# Altium project BOLLBOT.PrjPCB
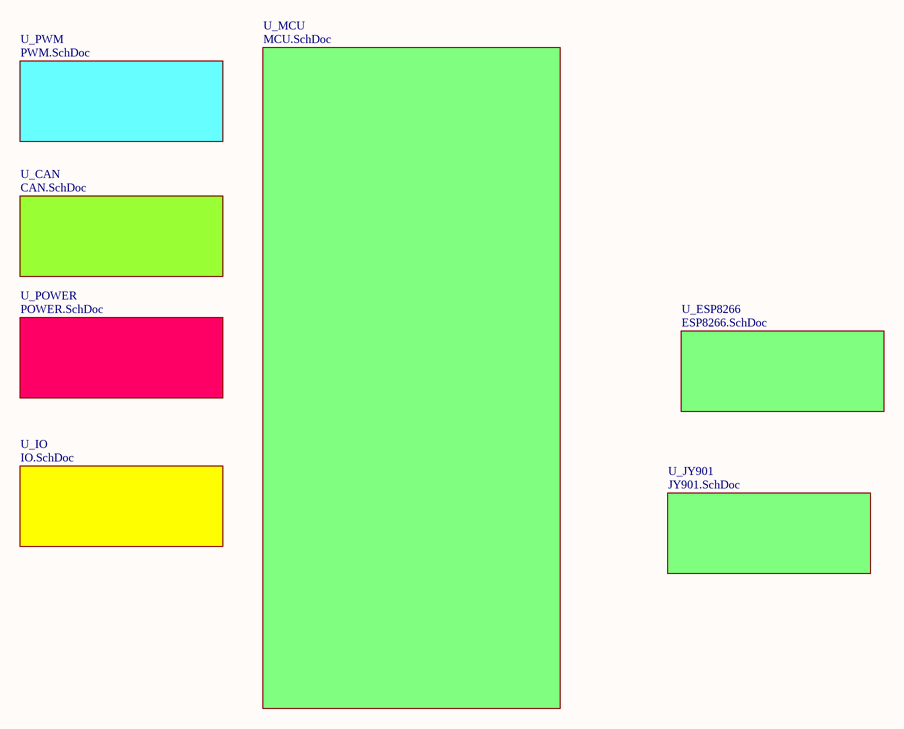
[diagram p0: Bollbot_V100.SchDoc]
8 sheets, 132 parts. Net scope: flat (ports and power ports of the same name join across sheets).
Board file: Bollbot_V100.PcbDoc
Sheets:
  Bollbot_V100.SchDoc
    U_MCU = MCU.SchDoc
    U_IO = IO.SchDoc
    U_CAN = CAN.SchDoc
    U_PWM = PWM.SchDoc
    U_POWER = Power.SchDoc
    U_ESP8266 = ESP8266.SchDoc
    U_JY901 = JY901.SchDoc

## Sheet Bollbot_V100.SchDoc
size A4

### Sub-sheets
U_CAN = CAN.SchDoc: no entries
U_ESP8266 = ESP8266.SchDoc: no entries
U_IO = IO.SchDoc: no entries
U_JY901 = JY901.SchDoc: no entries
U_MCU = MCU.SchDoc: no entries
U_POWER = POWER.SchDoc: no entries
U_PWM = PWM.SchDoc: no entries

## Sheet MCU.SchDoc
size A3
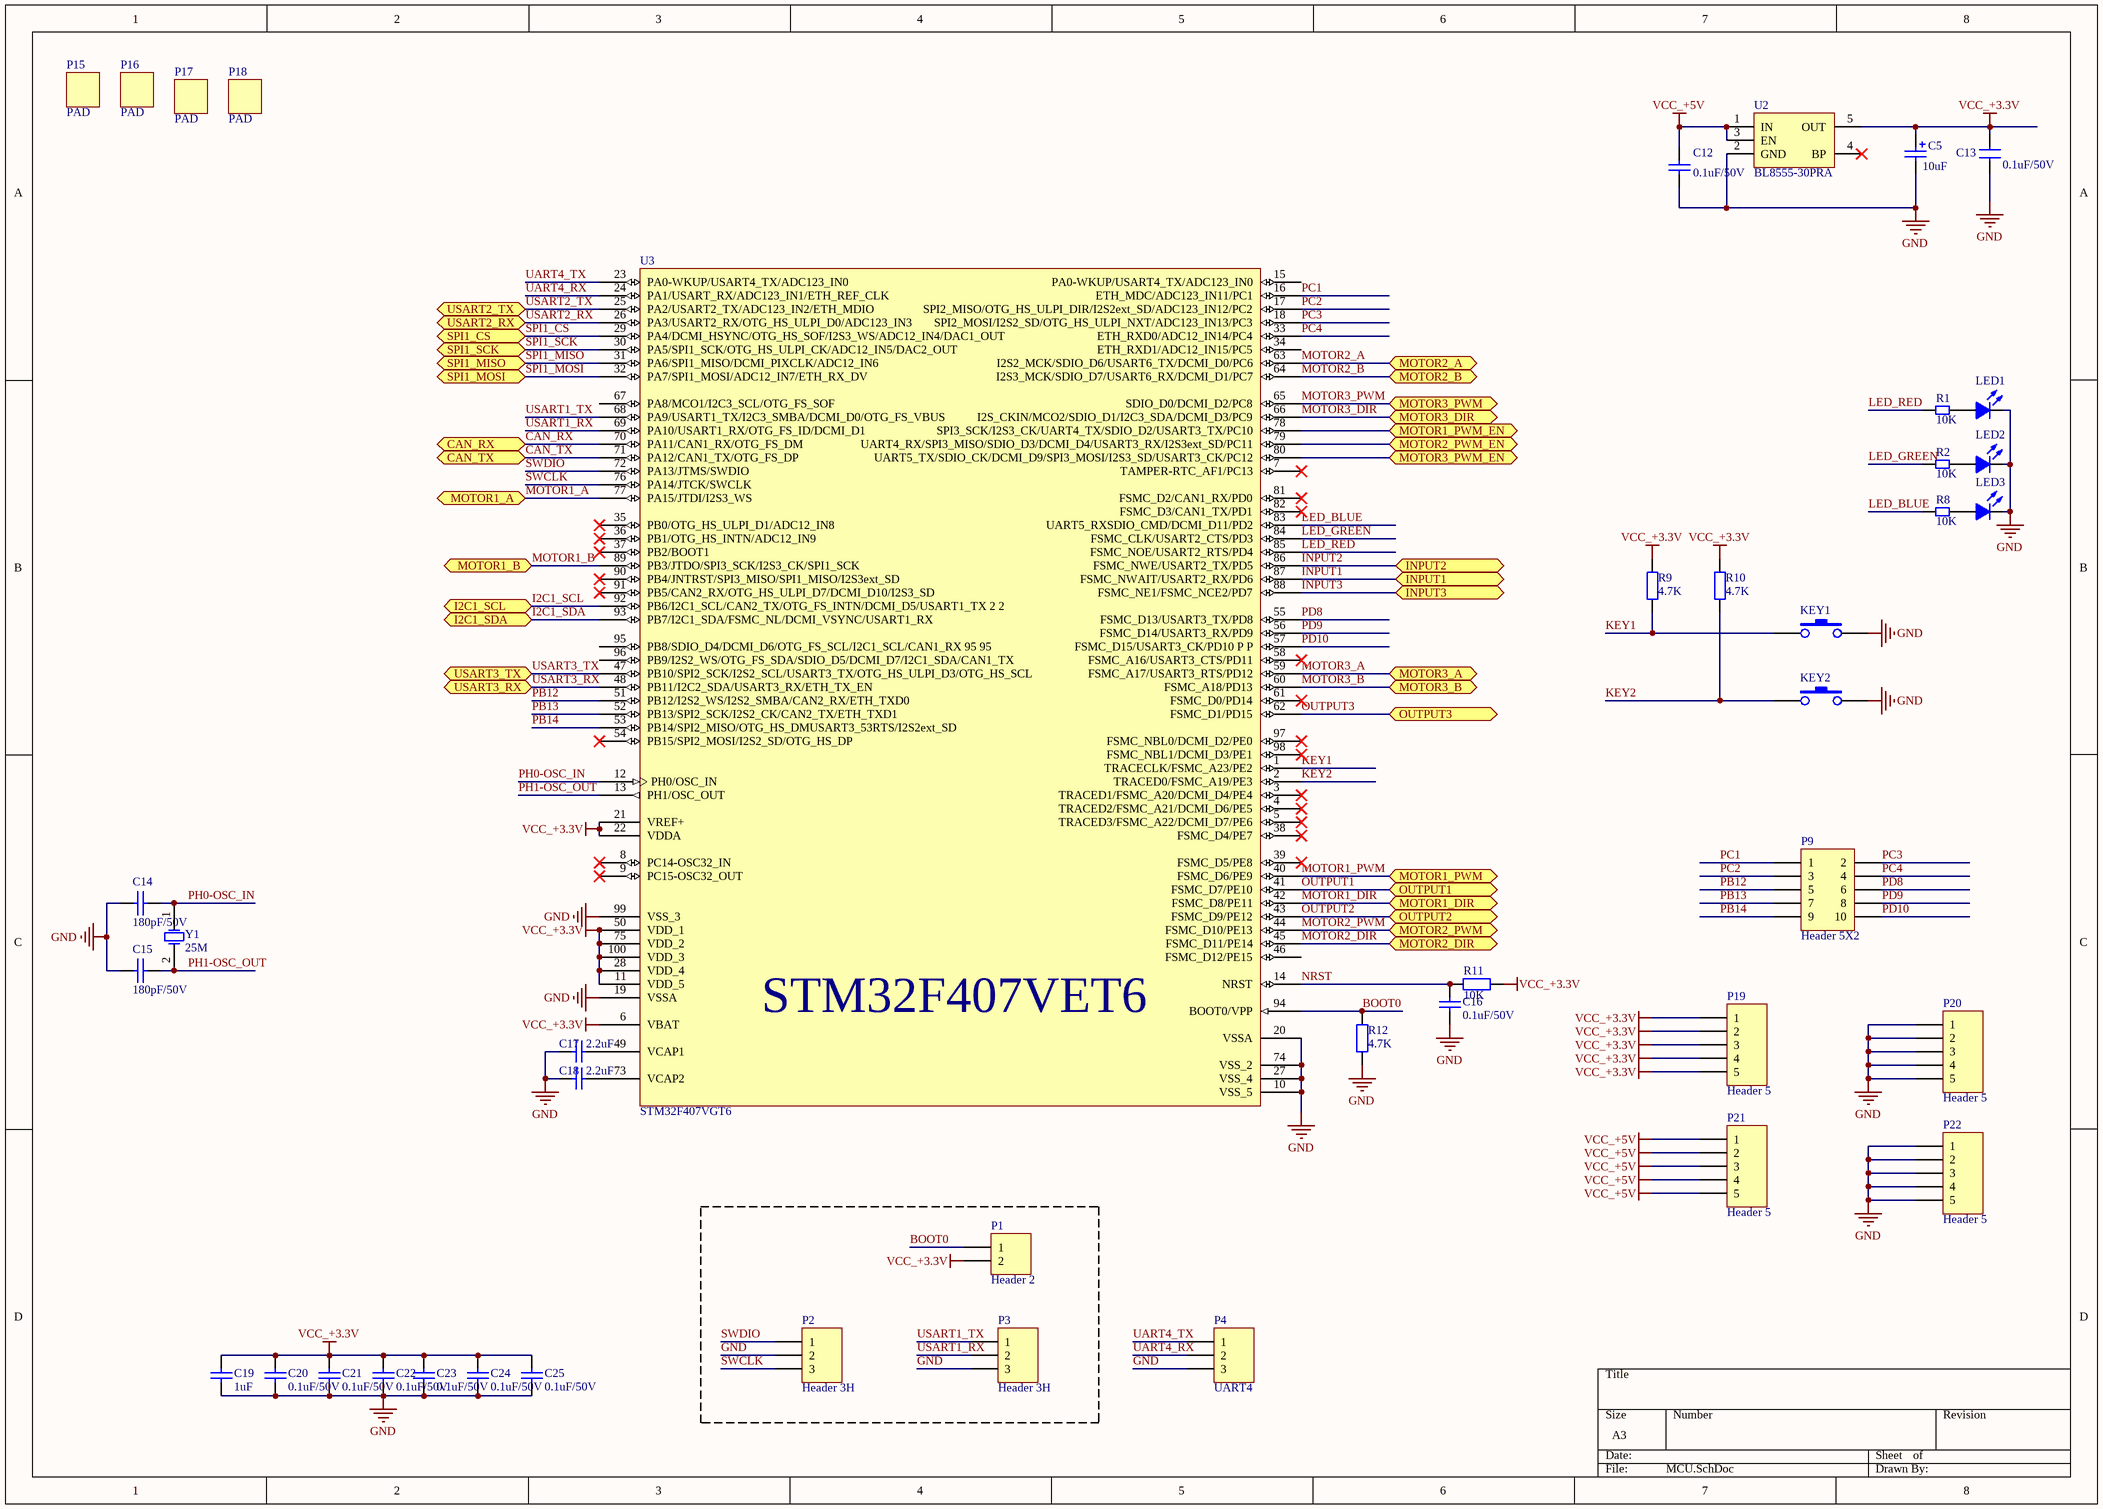
[diagram p1: MCU.SchDoc]

### Parts
C5  10uF  [CAPTANC]
C12  0.1uF/50V  [0603C]
C13  0.1uF/50V  [0603C]
C14  180pF/50V  [0603C]
C15  180pF/50V  [0603C]
C16  0.1uF/50V  [0603C]
C17  2.2uF  [0603C]
C18  2.2uF  [0603C]
C19  1uF  [0603C]
C20  0.1uF/50V  [0603C]
C21  0.1uF/50V  [0603C]
C22  0.1uF/50V  [0603C]
C23  0.1uF/50V  [0603C]
C24  0.1uF/50V  [0603C]
C25  0.1uF/50V  [0603C]
KEY1  (no value)  [KEY_SMT]
KEY2  (no value)  [KEY_SMT]
LED1  LED  [LED-0603]  (value not drawn)
LED2  LED  [LED-0603]  (value not drawn)
LED3  LED  [LED-0603]  (value not drawn)
P1  Header 2  [HDR1*2]
P2  Header 3H  [XH254-3P]
P3  Header 3H  [XH254-3P]
P4  UART4  [XH254-3P]
P9  Header 5X2  [HDR2X5]
P15  PAD  [PAD 3mm]
P16  PAD  [PAD 3mm]
P17  PAD  [PAD 3mm]
P18  PAD  [PAD 3mm]
P19  Header 5  [HDR1X5]
P20  Header 5  [HDR1X5]
P21  Header 5  [HDR1X5]
P22  Header 5  [HDR1X5]
R1  10K  [0603R]
R2  10K  [0603R]
R8  10K  [0603R]
R9  4.7K  [0603R]
R10  4.7K  [0603R]
R11  10K  [0603R]
R12  4.7K  [0603R]
U2  BL8555-30PRA  [SOT23-5]
U3  STM32F407VGT6  [LQFP-100_14x14x05P]
Y1  25M  [XTAL]

### Ports
CAN_RX (bidir), CAN_TX (bidir), I2C1_SCL, I2C1_SDA, INPUT1, INPUT2, INPUT3, MOTOR1_A, MOTOR1_B, MOTOR1_DIR, MOTOR1_PWM, MOTOR1_PWM_EN, MOTOR2_A, MOTOR2_B, MOTOR2_DIR, MOTOR2_PWM, MOTOR2_PWM_EN, MOTOR3_A, MOTOR3_B, MOTOR3_DIR, MOTOR3_PWM, MOTOR3_PWM_EN, OUTPUT1, OUTPUT2, OUTPUT3, SPI1_CS, SPI1_MISO, SPI1_MOSI, SPI1_SCK, USART2_RX (bidir), USART2_TX (bidir), USART3_RX (bidir), USART3_TX (bidir)

### Nets
GND: C5.2 C12.1 C13.2 C14.1 C15.1 C16.1 C17.2 C18.2 C19.1 C20.1 C21.1 C22.1 C23.1 C24.1 C25.1 KEY1.2 KEY2.2 LED1.2(K) LED2.2(K) LED3.2(K) P2.2 P3.3 P4.3 P20.1 P20.2 P20.3 P20.4 P20.5 P22.1 P22.2 P22.3 P22.4 P22.5 R12.1 U2.2(GND) U3.10(VSS_5) U3.19(VSSA) U3.20(VSSA) U3.27(VSS_4) U3.74(VSS_2) U3.99(VSS_3)
VCC_+3.3V: C5.1 C13.1 C19.2 C20.2 C21.2 C22.2 C23.2 C24.2 C25.2 P1.2 P19.1 P19.2 P19.3 P19.4 P19.5 R9.1 R10.1 R11.1 U2.5(OUT) U3.6(VBAT) U3.11(VDD_5) U3.21(VREF+) U3.22(VDDA) U3.28(VDD_4) U3.50(VDD_1) U3.75(VDD_2) U3.100(VDD_3)
VCC_+5V: C12.2 P21.1 P21.2 P21.3 P21.4 P21.5 U2.1(IN) U2.3(EN)
BOOT0: P1.1 R12.2 U3.94(BOOT0/VPP)
CAN_RX: U3.70(PA11/CAN1_RX/OTG_FS_DM) ; port CAN_RX
CAN_TX: U3.71(PA12/CAN1_TX/OTG_FS_DP) ; port CAN_TX
I2C1_SCL: U3.92(PB6/I2C1_SCL/CAN2_TX/OTG_FS_INTN/DCMI_D5/USART1_TX_2_2) ; port I2C1_SCL
I2C1_SDA: U3.93(PB7/I2C1_SDA/FSMC_NL/DCMI_VSYNC/USART1_RX) ; port I2C1_SDA
INPUT1: U3.87(FSMC_NWAIT/USART2_RX/PD6) ; port INPUT1
INPUT2: U3.86(FSMC_NWE/USART2_TX/PD5) ; port INPUT2
INPUT3: U3.88(FSMC_NE1/FSMC_NCE2/PD7) ; port INPUT3
KEY1: KEY1.1 R9.2 U3.1(TRACECLK/FSMC_A23/PE2)
KEY2: KEY2.1 R10.2 U3.2(TRACED0/FSMC_A19/PE3)
LED_BLUE: R8.1 U3.83(UART5_RXSDIO_CMD/DCMI_D11/PD2)
LED_GREEN: R2.1 U3.84(FSMC_CLK/USART2_CTS/PD3)
LED_RED: R1.1 U3.85(FSMC_NOE/USART2_RTS/PD4)
MOTOR1_A: U3.77(PA15/JTDI/I2S3_WS) ; port MOTOR1_A
MOTOR1_B: U3.89(PB3/JTDO/SPI3_SCK/I2S3_CK/SPI1_SCK) ; port MOTOR1_B
MOTOR1_DIR: U3.42(FSMC_D8/PE11) ; port MOTOR1_DIR
MOTOR1_PWM: U3.40(FSMC_D6/PE9) ; port MOTOR1_PWM
MOTOR2_A: U3.63(I2S2_MCK/SDIO_D6/USART6_TX/DCMI_D0/PC6) ; port MOTOR2_A
MOTOR2_B: U3.64(I2S3_MCK/SDIO_D7/USART6_RX/DCMI_D1/PC7) ; port MOTOR2_B
MOTOR2_DIR: U3.45(FSMC_D11/PE14) ; port MOTOR2_DIR
MOTOR2_PWM: U3.44(FSMC_D10/PE13) ; port MOTOR2_PWM
MOTOR3_A: U3.59(FSMC_A17/USART3_RTS/PD12) ; port MOTOR3_A
MOTOR3_B: U3.60(FSMC_A18/PD13) ; port MOTOR3_B
MOTOR3_DIR: U3.66(I2S_CKIN/MCO2/SDIO_D1/I2C3_SDA/DCMI_D3/PC9) ; port MOTOR3_DIR
MOTOR3_PWM: U3.65(SDIO_D0/DCMI_D2/PC8) ; port MOTOR3_PWM
NRST: C16.2 R11.2 U3.14(NRST)
OUTPUT1: U3.41(FSMC_D7/PE10) ; port OUTPUT1
OUTPUT2: U3.43(FSMC_D9/PE12) ; port OUTPUT2
OUTPUT3: U3.62(FSMC_D1/PD15) ; port OUTPUT3
PB12: P9.5 U3.51(PB12/I2S2_WS/I2S2_SMBA/CAN2_RX/ETH_TXD0)
PB13: P9.7 U3.52(PB13/SPI2_SCK/I2S2_CK/CAN2_TX/ETH_TXD1)
PB14: P9.9 U3.53(PB14/SPI2_MISO/OTG_HS_DMUSART3_53RTS/I2S2ext_SD)
PC1: P9.1 U3.16(ETH_MDC/ADC123_IN11/PC1)
PC2: P9.3 U3.17(SPI2_MISO/OTG_HS_ULPI_DIR/I2S2ext_SD/ADC123_IN12/PC2)
PC3: P9.2 U3.18(SPI2_MOSI/I2S2_SD/OTG_HS_ULPI_NXT/ADC123_IN13/PC3)
PC4: P9.4 U3.33(ETH_RXD0/ADC12_IN14/PC4)
PD8: P9.6 U3.55(FSMC_D13/USART3_TX/PD8)
PD9: P9.8 U3.56(FSMC_D14/USART3_RX/PD9)
PD10: P9.10 U3.57(FSMC_D15/USART3_CK/PD10_P_P)
PH0-OSC_IN: C14.2 U3.12(PH0/OSC_IN) Y1.1(OSC1)
PH1-OSC_OUT: C15.2 U3.13(PH1/OSC_OUT) Y1.2(OSC2)
SPI1_CS: U3.29(PA4/DCMI_HSYNC/OTG_HS_SOF/I2S3_WS/ADC12_IN4/DAC1_OUT) ; port SPI1_CS
SPI1_MISO: U3.31(PA6/SPI1_MISO/DCMI_PIXCLK/ADC12_IN6) ; port SPI1_MISO
SPI1_MOSI: U3.32(PA7/SPI1_MOSI/ADC12_IN7/ETH_RX_DV) ; port SPI1_MOSI
SPI1_SCK: U3.30(PA5/SPI1_SCK/OTG_HS_ULPI_CK/ADC12_IN5/DAC2_OUT) ; port SPI1_SCK
SWCLK: P2.3 U3.76(PA14/JTCK/SWCLK)
SWDIO: P2.1 U3.72(PA13/JTMS/SWDIO)
UART4_RX: P4.2 U3.24(PA1/USART_RX/ADC123_IN1/ETH_REF_CLK)
UART4_TX: P4.1 U3.23(PA0-WKUP/USART4_TX/ADC123_IN0)
USART1_RX: P3.2 U3.69(PA10/USART1_RX/OTG_FS_ID/DCMI_D1)
USART1_TX: P3.1 U3.68(PA9/USART1_TX/I2C3_SMBA/DCMI_D0/OTG_FS_VBUS)
USART2_RX: U3.26(PA3/USART2_RX/OTG_HS_ULPI_D0/ADC123_IN3) ; port USART2_RX
USART2_TX: U3.25(PA2/USART2_TX/ADC123_IN2/ETH_MDIO) ; port USART2_TX
USART3_RX: U3.48(PB11/I2C2_SDA/USART3_RX/ETH_TX_EN) ; port USART3_RX
USART3_TX: U3.47(PB10/SPI2_SCK/I2S2_SCL/USART3_TX/OTG_HS_ULPI_D3/OTG_HS_SCL) ; port USART3_TX
NetC17_1: C17.1 U3.49(VCAP1)
NetC18_1: C18.1 U3.73(VCAP2)
NetLED1_1: LED1.1(A) R1.2
NetLED2_1: LED2.1(A) R2.2
NetLED3_1: LED3.1(A) R8.2
NetU3_78: U3.78(SPI3_SCK/I2S3_CK/UART4_TX/SDIO_D2/USART3_TX/PC10) ; port MOTOR1_PWM_EN
NetU3_79: U3.79(UART4_RX/SPI3_MISO/SDIO_D3/DCMI_D4/USART3_RX/I2S3ext_SD/PC11) ; port MOTOR2_PWM_EN
NetU3_80: U3.80(UART5_TX/SDIO_CK/DCMI_D9/SPI3_MOSI/I2S3_SD/USART3_CK/PC12) ; port MOTOR3_PWM_EN

Not connected (* = marked no-connect by the designer): U2 4(BP)*; U3 3(TRACED1/FSMC_A20/DCMI_D4/PE4)* 4(TRACED2/FSMC_A21/DCMI_D6/PE5)* 5(TRACED3/FSMC_A22/DCMI_D7/PE6)* 7(TAMPER-RTC_AF1/PC13)* 8(PC14-OSC32_IN)* 9(PC15-OSC32_OUT)* 15(PA0-WKUP/USART4_TX/ADC123_IN0) 34(ETH_RXD1/ADC12_IN15/PC5) 35(PB0/OTG_HS_ULPI_D1/ADC12_IN8)* 36(PB1/OTG_HS_INTN/ADC12_IN9)* 37(PB2/BOOT1)* 38(FSMC_D4/PE7)* 39(FSMC_D5/PE8)* 46(FSMC_D12/PE15) 54(PB15/SPI2_MOSI/I2S2_SD/OTG_HS_DP)* 58(FSMC_A16/USART3_CTS/PD11)* 61(FSMC_D0/PD14)* 67(PA8/MCO1/I2C3_SCL/OTG_FS_SOF) 81(FSMC_D2/CAN1_RX/PD0)* 82(FSMC_D3/CAN1_TX/PD1)* 90(PB4/JNTRST/SPI3_MISO/SPI1_MISO/I2S3ext_SD)* 91(PB5/CAN2_RX/OTG_HS_ULPI_D7/DCMI_D10/I2S3_SD)* 95(PB8/SDIO_D4/DCMI_D6/OTG_FS_SCL/I2C1_SCL/CAN1_RX_95_95) 96(PB9/I2S2_WS/OTG_FS_SDA/SDIO_D5/DCMI_D7/I2C1_SDA/CAN1_TX) 97(FSMC_NBL0/DCMI_D2/PE0)* 98(FSMC_NBL1/DCMI_D3/PE1)*

### Notes on the sheet
- (in symbol STM32F407VGT6) STM32F407VET6

### Library data of the parts
C5 = Cap Pol: Polarized Capacitor (Radial); Published: 8-Jun-2000; LatestRevisionDate: 17-Jul-2002; LatestRevisionNote: Re-released for DXP Platform.; Publisher: Altium Limited; Value: 10uF
C12 C16-C25 = Cap: Capacitor; Value: 104; Published: 8-Jun-2000; LatestRevisionDate: 17-Jul-2002; LatestRevisionNote: Re-released for DXP Platform.; Publisher: Altium Limited
C13 = CAP
C14 C15 = 0603C
KEY1 KEY2 = SW-PB
LED1-LED3 = LED: Typical INFRARED GaAs LED; Published: 8-Jun-2000; LatestRevisionDate: 17-Jul-2002; LatestRevisionNote: Re-released for DXP Platform.; Publisher: Altium Limited
P1 = Header 2: Header, 2-Pin; LatestRevisionDate: 17-Jul-2002; LatestRevisionNote: Re-released for DXP Platform.; Publisher: Altium Limited
P2-P4 = Header 3H: Header, 3-Pin, Right Angle; LatestRevisionDate: 17-Jul-2002; LatestRevisionNote: Re-released for DXP Platform.; Publisher: Altium Limited
P9 = Header 5X2: Header, 5-Pin, Dual row; LatestRevisionDate: 17-Jul-2002; LatestRevisionNote: Re-released for DXP Platform.; Publisher: Altium Limited
P19-P22 = Header 5: Header, 5-Pin; LatestRevisionDate: 17-Jul-2002; LatestRevisionNote: Re-released for DXP Platform.; Publisher: Altium Limited
R1 R2 R8 = Res2: Resistor; Value: 1K; Published: 8-Jun-2000; LatestRevisionDate: 17-Jul-2002; LatestRevisionNote: Re-released for DXP Platform.; Publisher: Altium Limited
R9-R12 = 0603R
U2 = SGM2019
Y1 = XTAL: Crystal Oscillator; Published: 8-Jun-2000; LatestRevisionDate: 17-Jul-2002; LatestRevisionNote: Re-released for DXP Platform.; PackageReference: R38; Publisher: Altium Limited

## Sheet IO.SchDoc
size A4
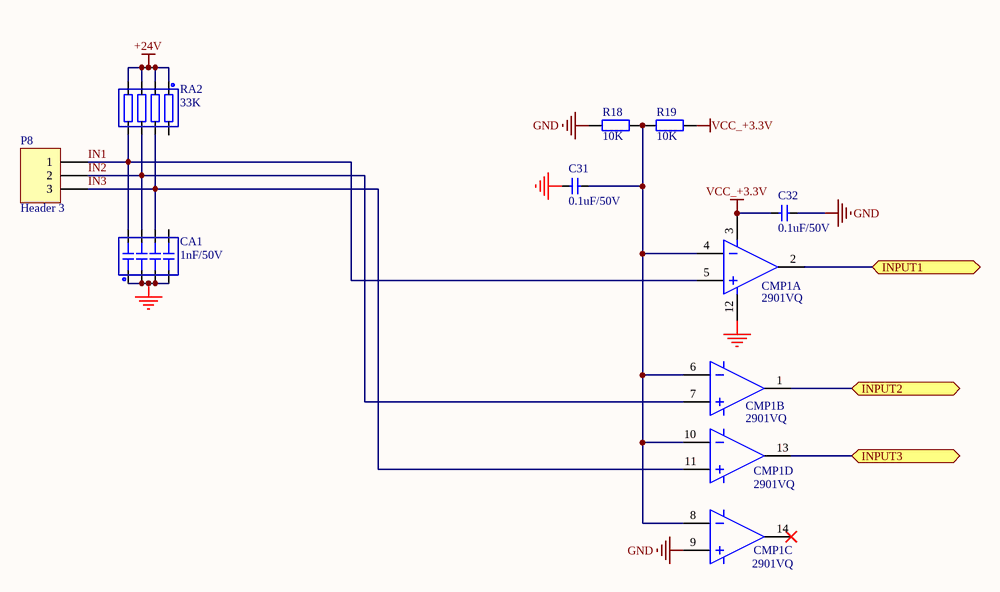
[diagram p2: IO.SchDoc]

### Parts
C31  0.1uF/50V  [0603c]
C32  0.1uF/50V  [0603C]
CA1  1nF/50V  [RES_PACK_SMD_E]
CMP1  2901VQ  [TSSOP14]  (parts A,B,C,D of 4)
P8  Header 3  [HT396  3P]
R18  10K  [0603R]
R19  10K  [0603R]
RA2  33K  [RES_PACK_SMD_E]

### Ports
INPUT1, INPUT2, INPUT3

### Nets
+24V: RA2.1 RA2.2 RA2.3 RA2.4
GND: C31.2 C32.2 CA1.1 CA1.2 CA1.3 CA1.4 CMP1.9 CMP1.12 R18.1
VCC_+3.3V: C32.1 CMP1.3 R19.2
IN1: CA1.8 CMP1.5 P8.1 RA2.5
IN2: CA1.7 CMP1.7 P8.2 RA2.6
IN3: CA1.6 CMP1.11 P8.3 RA2.7
INPUT1: CMP1.2 ; port INPUT1
INPUT2: CMP1.1 ; port INPUT2
INPUT3: CMP1.13 ; port INPUT3
NetC31_1: C31.1 CMP1.4 CMP1.6 CMP1.8 CMP1.10 R18.2 R19.1

Not connected (* = marked no-connect by the designer): CA1 5; CMP1 14*; RA2 8

### Library data of the parts
C31 C32 = CAP
CA1 = CAP_PACK4
CMP1 = LM339
P8 = Header 3: Header, 3-Pin; LatestRevisionDate: 17-Jul-2002; LatestRevisionNote: Re-released for DXP Platform.; Publisher: Altium Limited
R18 R19 = 0603R
RA2 = RESPACK4

## Sheet CAN.SchDoc
size A4
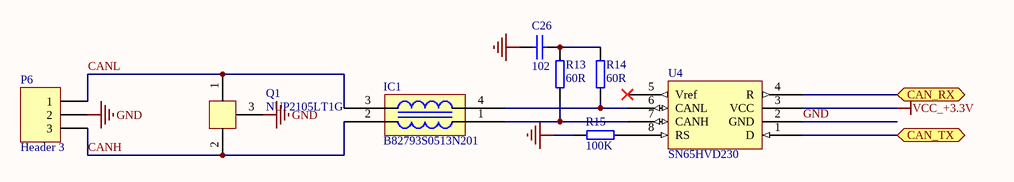
[diagram p3: CAN.SchDoc]

### Parts
C26  102  [0603C]
IC1  B82793S0513N201  [EPCOS_Chokes]
P6  Header 3  [XH254-3P]
Q1  NUP2105LT1G  [SOT23]
R13  60R  [0603R]
R14  60R  [0603R]
R15  100K  [0603R]
U4  SN65HVD230  [SOP8]

### Ports
CAN_RX (bidir), CAN_TX (bidir)

### Nets
GND: C26.1 P6.2 Q1.3 R15.2 U4.2(GND)
VCC_+3.3V: U4.3(VCC)
CAN_RX: U4.4(R) ; port CAN_RX
CAN_TX: U4.1(D) ; port CAN_TX
CANH: IC1.2 P6.3 Q1.2
CANL: IC1.3 P6.1 Q1.1
NetC26_2: C26.2 R13.2 R14.2
NetIC1_1: IC1.1 R13.1 U4.7(CANH)
NetIC1_4: IC1.4 R14.1 U4.6(CANL)
NetR15_1: R15.1 U4.8(RS)

Not connected (* = marked no-connect by the designer): U4 5(Vref)*

### Library data of the parts
C26 = CAP: Capacitor
IC1 = EPCOS Chokes: Common-mode chokes, ring core
P6 = Header 3: Header, 3-Pin; LatestRevisionDate: 17-Jul-2002; LatestRevisionNote: Re-released for DXP Platform.; Publisher: Altium Limited
Q1 = SOT23
R13-R15 = RES2A
U4 = SN65HVD230D

## Sheet PWM.SchDoc
size A4
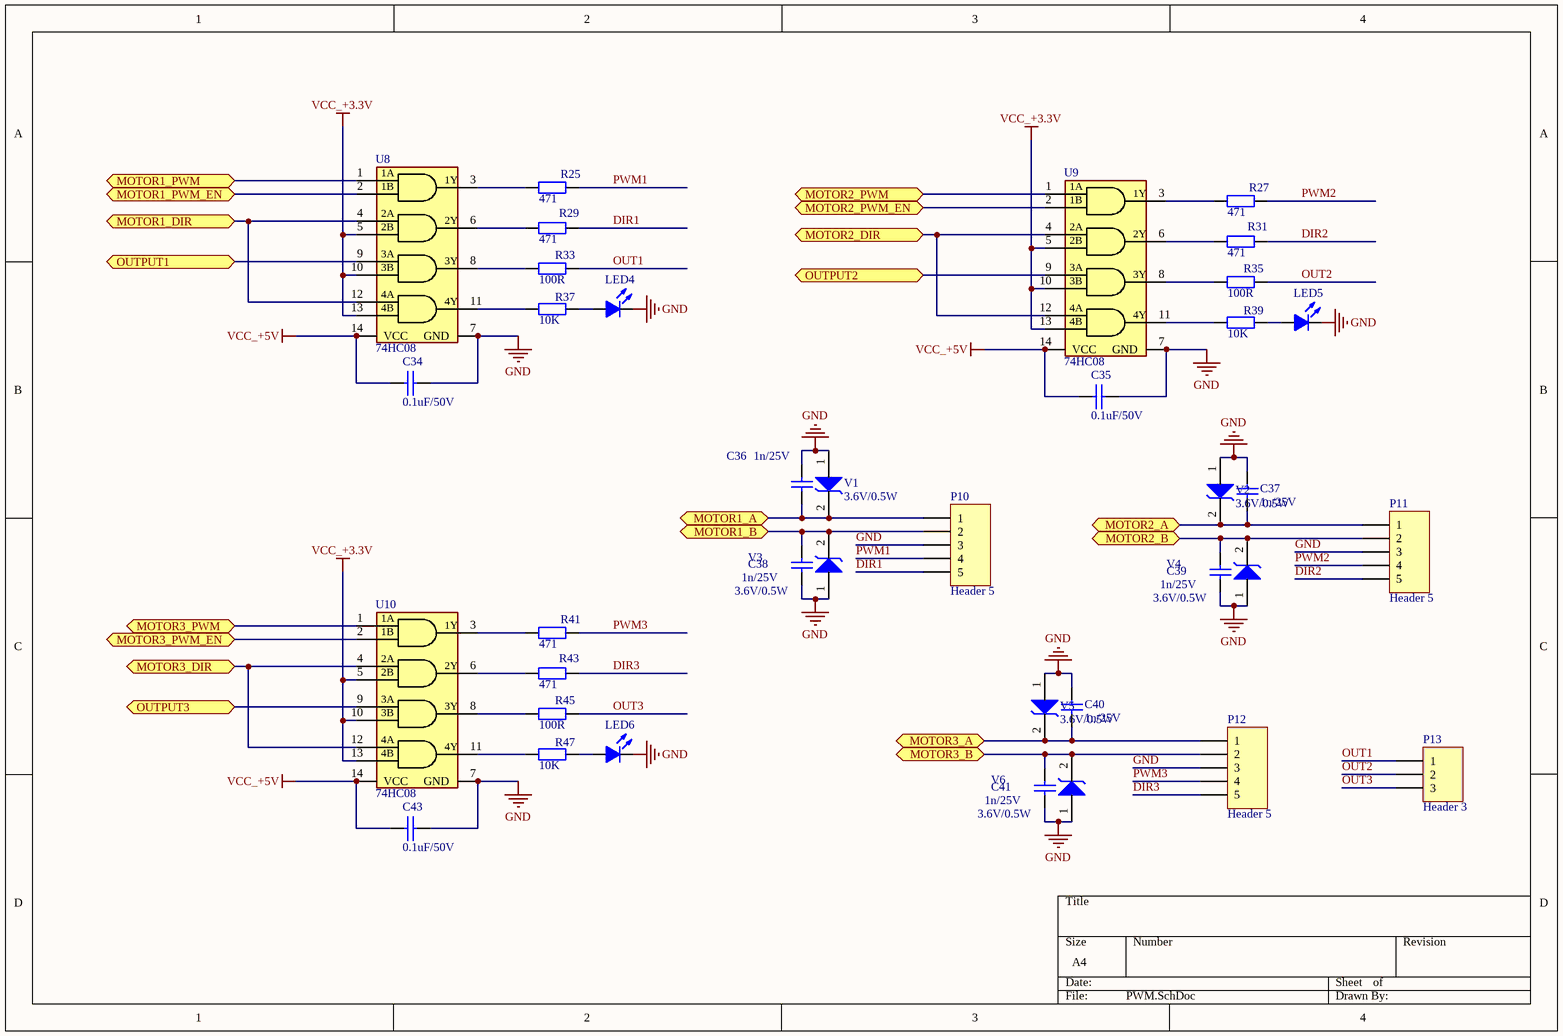
[diagram p4: PWM.SchDoc]

### Parts
C34  0.1uF/50V  [0603C]
C35  0.1uF/50V  [0603C]
C36  1n/25V  [0603C]
C37  1n/25V  [0603C]
C38  1n/25V  [0603C]
C39  1n/25V  [0603C]
C40  1n/25V  [0603C]
C41  1n/25V  [0603C]
C43  0.1uF/50V  [0603C]
LED4  LED  [LED-0603]  (value not drawn)
LED5  LED  [LED-0603]  (value not drawn)
LED6  LED  [LED-0603]  (value not drawn)
P10  Header 5  [HT396]
P11  Header 5  [HT396]
P12  Header 5  [HT396]
P13  Header 3  [HT396  3P]
R25  471  [0603R]
R27  471  [0603R]
R29  471  [0603R]
R31  471  [0603R]
R33  100R  [0603R]
R35  100R  [0603R]
R37  10K  [0603R]
R39  10K  [0603R]
R41  471  [0603R]
R43  471  [0603R]
R45  100R  [0603R]
R47  10K  [0603R]
U8  74HC08  [SOP14]
U9  74HC08  [SOP14]
U10  74HC08  [SOP14]
V1  3.6V/0.5W  [1206D]
V2  3.6V/0.5W  [1206D]
V3  3.6V/0.5W  [1206D]
V4  3.6V/0.5W  [1206D]
V5  3.6V/0.5W  [1206D]
V6  3.6V/0.5W  [1206D]

### Ports
MOTOR1_A, MOTOR1_B, MOTOR1_DIR, MOTOR1_PWM, MOTOR1_PWM_EN, MOTOR2_A, MOTOR2_B, MOTOR2_DIR, MOTOR2_PWM, MOTOR2_PWM_EN, MOTOR3_A, MOTOR3_B, MOTOR3_DIR, MOTOR3_PWM, MOTOR3_PWM_EN, OUTPUT1, OUTPUT2, OUTPUT3

### Nets
GND: C34.2 C35.2 C36.2 C37.1 C38.1 C39.1 C40.1 C41.1 C43.2 LED4.2(K) LED5.2(K) LED6.2(K) P10.3 P11.3 P12.3 U8.7(GND) U9.7(GND) U10.7(GND) V1.1 V2.1 V3.1 V4.1 V5.1 V6.1
VCC_+3.3V: U8.5 U8.10(1B) U8.13 U9.5 U9.10(1B) U9.13 U10.5 U10.10(1B) U10.13
VCC_+5V: C34.1 C35.1 C43.1 U8.14(VCC) U9.14(VCC) U10.14(VCC)
DIR1: P10.5 R29.1
DIR2: P11.5 R31.1
DIR3: P12.5 R43.1
MOTOR1_A: C36.1 P10.1 V1.2 ; port MOTOR1_A
MOTOR1_B: C38.2 P10.2 V3.2 ; port MOTOR1_B
MOTOR1_DIR: U8.4 U8.12 ; port MOTOR1_DIR
MOTOR1_PWM: U8.1(1A) ; port MOTOR1_PWM
MOTOR2_A: C37.2 P11.1 V2.2 ; port MOTOR2_A
MOTOR2_B: C39.2 P11.2 V4.2 ; port MOTOR2_B
MOTOR2_DIR: U9.4 U9.12 ; port MOTOR2_DIR
MOTOR2_PWM: U9.1(1A) ; port MOTOR2_PWM
MOTOR3_A: C40.2 P12.1 V5.2 ; port MOTOR3_A
MOTOR3_B: C41.2 P12.2 V6.2 ; port MOTOR3_B
MOTOR3_DIR: U10.4 U10.12 ; port MOTOR3_DIR
MOTOR3_PWM: U10.1(1A) ; port MOTOR3_PWM
OUT1: P13.1 R33.1
OUT2: P13.2 R35.1
OUT3: P13.3 R45.1
OUTPUT1: U8.9 ; port OUTPUT1
OUTPUT2: U9.9 ; port OUTPUT2
OUTPUT3: U10.9 ; port OUTPUT3
PWM1: P10.4 R25.1
PWM2: P11.4 R27.1
PWM3: P12.4 R41.1
NetLED4_1: LED4.1(A) R37.1
NetLED5_1: LED5.1(A) R39.1
NetLED6_1: LED6.1(A) R47.1
NetR25_2: R25.2 U8.3(1Y)
NetR27_2: R27.2 U9.3(1Y)
NetR29_2: R29.2 U8.6
NetR31_2: R31.2 U9.6
NetR33_2: R33.2 U8.8
NetR35_2: R35.2 U9.8
NetR37_2: R37.2 U8.11
NetR39_2: R39.2 U9.11
NetR41_2: R41.2 U10.3(1Y)
NetR43_2: R43.2 U10.6
NetR45_2: R45.2 U10.8
NetR47_2: R47.2 U10.11
NetU3_78: U8.2(1B) ; port MOTOR1_PWM_EN
NetU3_79: U9.2(1B) ; port MOTOR2_PWM_EN
NetU3_80: U10.2(1B) ; port MOTOR3_PWM_EN

### Notes on the sheet
- (in symbol 74HC08) 2A; 2Y; 2B; 3A; 3Y; 3B; 4A; 4Y; 4B

### Library data of the parts
C34 C35 C43 = 0603C
C36-C41 = Cap: Capacitor
LED4-LED6 = LED: Typical INFRARED GaAs LED; Published: 8-Jun-2000; LatestRevisionDate: 17-Jul-2002; LatestRevisionNote: Re-released for DXP Platform.; Publisher: Altium Limited
P10-P12 = Header 5: Header, 5-Pin; LatestRevisionDate: 17-Jul-2002; LatestRevisionNote: Re-released for DXP Platform.; Publisher: Altium Limited
P13 = Header 3: Header, 3-Pin; LatestRevisionDate: 17-Jul-2002; LatestRevisionNote: Re-released for DXP Platform.; Publisher: Altium Limited
R25 R27 R29 R31 R33 R35 R37 R39 R41 R43 R45 R47 = 0603R
U8-U10 = 74HC08: Quad 2-input NAND gate
V1-V6 = DIODE-SCHOTTKY: DIODE SCHOTTKY

## Sheet Power.SchDoc
size A4
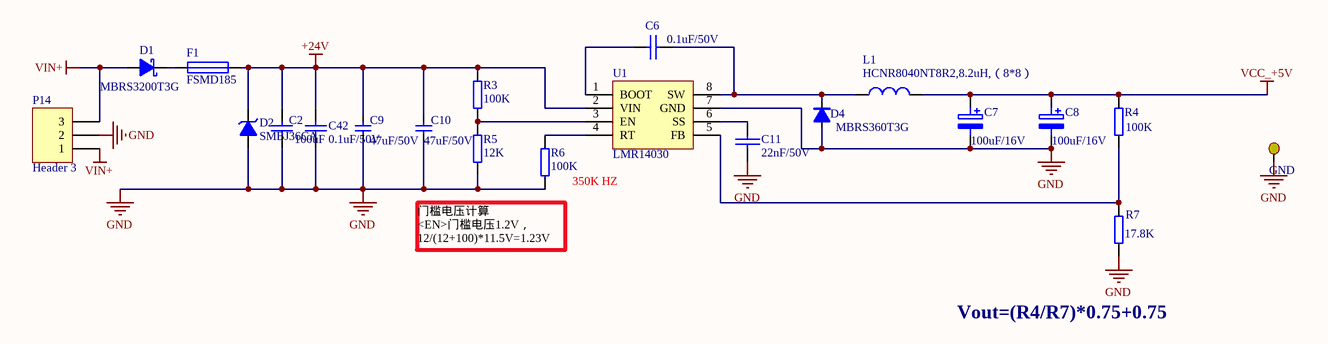
[diagram p5: Power.SchDoc]

### Parts
C2  100uF  [CAP 8X12 -2]
C6  0.1uF/50V  [0603C]
C7  100uF/16V  [CAPTANC]
C8  100uF/16V  [CAPTANC]
C9  47uF/50V  [1812C]
C10  47uF/50V  [1812C]
C11  22nF/50V  [0603C]
C42  0.1uF/50V  [1206C]
D1  MBRS3200T3G  [DO-214AA]
D2  SMBJ36CA  [DO-214AA]
D4  MBRS360T3G  [DO214AB]
F1  FSMD185  [1812R - duplicate1]
GND  Test Point  [TestPoint-2]  (value not drawn)
L1  HCNR8040NT8R2,8.2uH,（8*8）  [电感]
P14  Header 3  [HT396  3P]
R3  100K  [0603R]
R4  100K  [0603R]
R5  12K  [0603R]
R6  100K  [0603R]
R7  17.8K  [0603R]
U1  LMR14030  [LMR14030]

### Nets
+24V: C2.2 C9.1 C10.1 C42.2 D2.2(K) F1.2 R3.1 U1.2(VIN)
GND: C2.1 C7.2 C8.2 C9.2 C10.2 C11.1 C42.1 D2.1(A) D4.1 GND.0 P14.2 R5.1 R6.1 R7.2 U1.7(GND)
VCC_+5V: C7.1 C8.1 L1.2 R4.1
VIN+: D1.1(A) P14.1 P14.3
NetC6_1: C6.1 D4.2 L1.1 U1.8(SW)
NetC6_2: C6.2 U1.1(BOOT)
NetC11_2: C11.2 U1.6(SS)
NetD1_2: D1.2(K) F1.1
NetR3_2: R3.2 R5.2 U1.3(EN)
NetR4_2: R4.2 R7.1 U1.5(FB)
NetR6_2: R6.2 U1.4(RT)

### Notes on the sheet
- 350K HZ
- 门槛电压计算
  <EN>门槛电压1.2V，
  12/(12+100)*11.5V=1.23V
- Vout=(R4/R7)*0.75+0.75

### Library data of the parts
C2 C42 = Cap: Capacitor; Value: 104; Published: 8-Jun-2000; LatestRevisionDate: 17-Jul-2002; LatestRevisionNote: Re-released for DXP Platform.; Publisher: Altium Limited
C6 C11 = 0603C
C7 C8 = EC: Electrolytic Capacitor; 钽?: *
C9 C10 = CAP
D1 = D Schottky: Schottky Diode; Published: 8-Jun-2000; LatestRevisionDate: 17-Jul-2002; LatestRevisionNote: Re-released for DXP Platform.; Publisher: Altium Limited; Code_JEDEC: DO-214-AA
D2 = D Zener: Zener Diode; Published: 8-Jun-2000; LatestRevisionDate: 17-Jul-2002; LatestRevisionNote: Re-released for DXP Platform.; Publisher: Altium Limited
D4 = DIODE_A
F1 = FUSE1: Fuse
GND = TestPoint
L1 = INDUCTOR: MSS1260T-103MLD  12*12 10UH 6.92A
P14 = Header 3: Header, 3-Pin; LatestRevisionDate: 17-Jul-2002; LatestRevisionNote: Re-released for DXP Platform.; Publisher: Altium Limited
R3-R7 = RES2A

## Sheet ESP8266.SchDoc
size A4
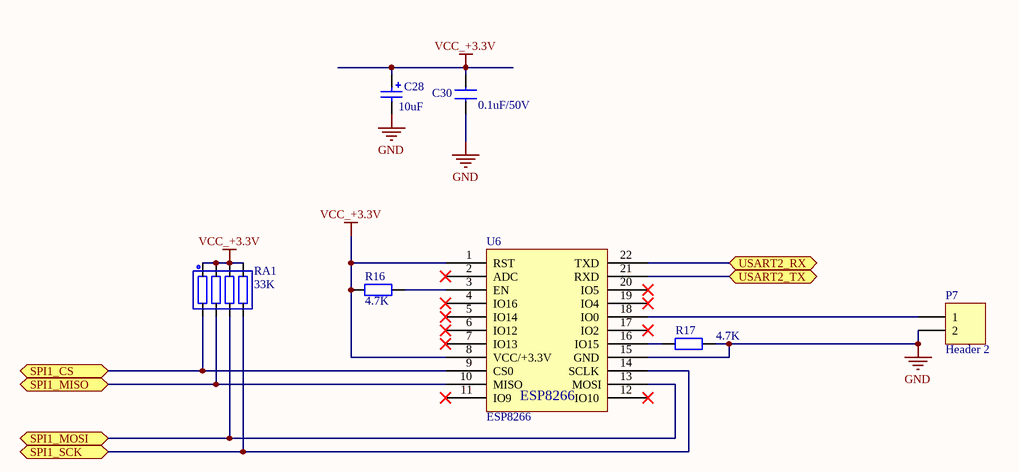
[diagram p6: ESP8266.SchDoc]

### Parts
C28  10uF  [CAPTANC]
C30  0.1uF/50V  [0603C]
P7  Header 2  [HDR1*2 - duplicate]
R16  4.7K  [0603R]
R17  4.7K  [0603R]
RA1  33K  [RES_PACK_SMD_E]
U6  ESP8266  [ESP8266]

### Ports
SPI1_CS, SPI1_MISO, SPI1_MOSI, SPI1_SCK, USART2_RX (bidir), USART2_TX (bidir)

### Nets
GND: C28.2 C30.2 P7.2 R17.2 U6.15(GND)
VCC_+3.3V: C28.1 C30.1 R16.1 RA1.1 RA1.2 RA1.3 RA1.4 U6.1(RST) U6.8(VCC/+3.3V)
SPI1_CS: RA1.8 U6.9(CS0) ; port SPI1_CS
SPI1_MISO: RA1.7 U6.10(MISO) ; port SPI1_MISO
SPI1_MOSI: RA1.6 U6.13(MOSI) ; port SPI1_MOSI
SPI1_SCK: RA1.5 U6.14(SCLK) ; port SPI1_SCK
USART2_RX: U6.22(TXD) ; port USART2_RX
USART2_TX: U6.21(RXD) ; port USART2_TX
NetP7_1: P7.1 U6.18(IO0)
NetR16_2: R16.2 U6.3(EN)
NetR17_1: R17.1 U6.16(IO15)

Not connected (* = marked no-connect by the designer): U6 2(ADC)* 4(IO16)* 5(IO14)* 6(IO12)* 7(IO13)* 11(IO9)* 12(IO10)* 17(IO2)* 19(IO4)* 20(IO5)*

### Library data of the parts
C28 = Cap Pol: Polarized Capacitor (Radial); Published: 8-Jun-2000; LatestRevisionDate: 17-Jul-2002; LatestRevisionNote: Re-released for DXP Platform.; Publisher: Altium Limited; Value: 10uF
C30 = CAP
P7 = Header 2: Header, 2-Pin; LatestRevisionDate: 17-Jul-2002; LatestRevisionNote: Re-released for DXP Platform.; Publisher: Altium Limited
R16 R17 = 0603R
RA1 = RESPACK4

## Sheet JY901.SchDoc
size A4
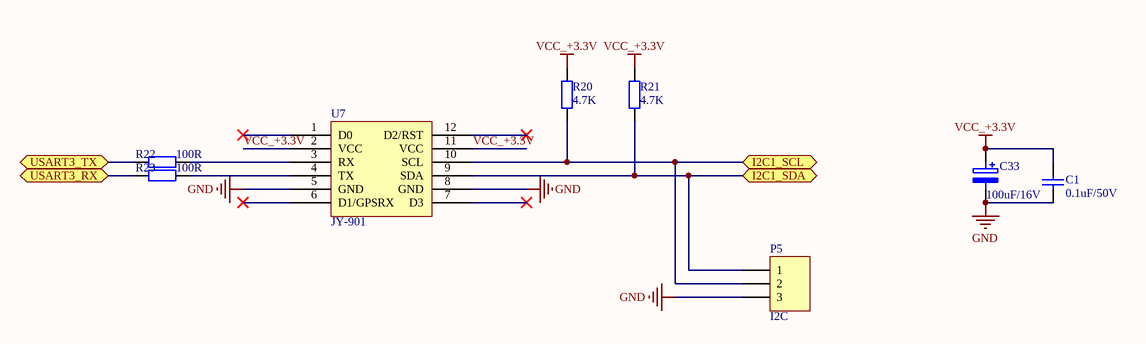
[diagram p7: JY901.SchDoc]

### Parts
C1  0.1uF/50V  [0603C]
C33  100uF/16V  [1206C]
P5  I2C  [XH254-3P]
R20  4.7K  [0603R]
R21  4.7K  [0603R]
R22  100R  [0603R]
R23  100R  [0603R]
U7  JY-901  [JY-901]

### Ports
I2C1_SCL, I2C1_SDA, USART3_RX (bidir), USART3_TX (bidir)

### Nets
GND: C1.1 C33.2 P5.3 U7.5(GND) U7.8(GND)
VCC_+3.3V: C1.2 C33.1 R20.1 R21.1 U7.2(VCC) U7.11(VCC)
I2C1_SCL: P5.2 R20.2 U7.10(SCL) ; port I2C1_SCL
I2C1_SDA: P5.1 R21.2 U7.9(SDA) ; port I2C1_SDA
USART3_RX: R23.1 ; port USART3_RX
USART3_TX: R22.1 ; port USART3_TX
NetR22_2: R22.2 U7.3(RX)
NetR23_2: R23.2 U7.4(TX)

Not connected (* = marked no-connect by the designer): U7 1(D0)* 6(D1/GPSRX)* 7(D3)* 12(D2/RST)*

### Library data of the parts
C1 = Cap: Capacitor; Value: 104; Published: 8-Jun-2000; LatestRevisionDate: 17-Jul-2002; LatestRevisionNote: Re-released for DXP Platform.; Publisher: Altium Limited
C33 = EC: Electrolytic Capacitor; 钽?: *
P5 = Header 3H: Header, 3-Pin, Right Angle; LatestRevisionDate: 17-Jul-2002; LatestRevisionNote: Re-released for DXP Platform.; Publisher: Altium Limited
R20-R23 = 0603R
U7 = JY-901: 君悦智控高精度9轴传感器

## Nets that join several sheets
+24V: IO (RA2.1 RA2.2 RA2.3 RA2.4), Power (8 pins)
GND: MCU (41 pins), IO (9 pins), CAN (5 pins), PWM (24 pins), Power (15 pins), ESP8266 (5 pins), JY901 (5 pins)
VCC_+3.3V: MCU (27 pins), IO (C32.1 CMP1.3 R19.2), CAN (U4.3), PWM (9 pins), ESP8266 (9 pins), JY901 (6 pins)
VCC_+5V: MCU (8 pins), PWM (6 pins), Power (C7.1 C8.1 L1.2 R4.1)
CAN_RX: MCU (U3.70), CAN (U4.4)
CAN_TX: MCU (U3.71), CAN (U4.1)
I2C1_SCL: MCU (U3.92), JY901 (P5.2 R20.2 U7.10)
I2C1_SDA: MCU (U3.93), JY901 (P5.1 R21.2 U7.9)
INPUT1: MCU (U3.87), IO (CMP1.2)
INPUT2: MCU (U3.86), IO (CMP1.1)
INPUT3: MCU (U3.88), IO (CMP1.13)
MOTOR1_A: MCU (U3.77), PWM (C36.1 P10.1 V1.2)
MOTOR1_B: MCU (U3.89), PWM (C38.2 P10.2 V3.2)
MOTOR1_DIR: MCU (U3.42), PWM (U8.4 U8.12)
MOTOR1_PWM: MCU (U3.40), PWM (U8.1)
MOTOR2_A: MCU (U3.63), PWM (C37.2 P11.1 V2.2)
MOTOR2_B: MCU (U3.64), PWM (C39.2 P11.2 V4.2)
MOTOR2_DIR: MCU (U3.45), PWM (U9.4 U9.12)
MOTOR2_PWM: MCU (U3.44), PWM (U9.1)
MOTOR3_A: MCU (U3.59), PWM (C40.2 P12.1 V5.2)
MOTOR3_B: MCU (U3.60), PWM (C41.2 P12.2 V6.2)
MOTOR3_DIR: MCU (U3.66), PWM (U10.4 U10.12)
MOTOR3_PWM: MCU (U3.65), PWM (U10.1)
NetU3_78: MCU (U3.78), PWM (U8.2)
NetU3_79: MCU (U3.79), PWM (U9.2)
NetU3_80: MCU (U3.80), PWM (U10.2)
OUTPUT1: MCU (U3.41), PWM (U8.9)
OUTPUT2: MCU (U3.43), PWM (U9.9)
OUTPUT3: MCU (U3.62), PWM (U10.9)
SPI1_CS: MCU (U3.29), ESP8266 (RA1.8 U6.9)
SPI1_MISO: MCU (U3.31), ESP8266 (RA1.7 U6.10)
SPI1_MOSI: MCU (U3.32), ESP8266 (RA1.6 U6.13)
SPI1_SCK: MCU (U3.30), ESP8266 (RA1.5 U6.14)
USART2_RX: MCU (U3.26), ESP8266 (U6.22)
USART2_TX: MCU (U3.25), ESP8266 (U6.21)
USART3_RX: MCU (U3.48), JY901 (R23.1)
USART3_TX: MCU (U3.47), JY901 (R22.1)